# EAGLE design safecode-box (EAGLE 6.2)
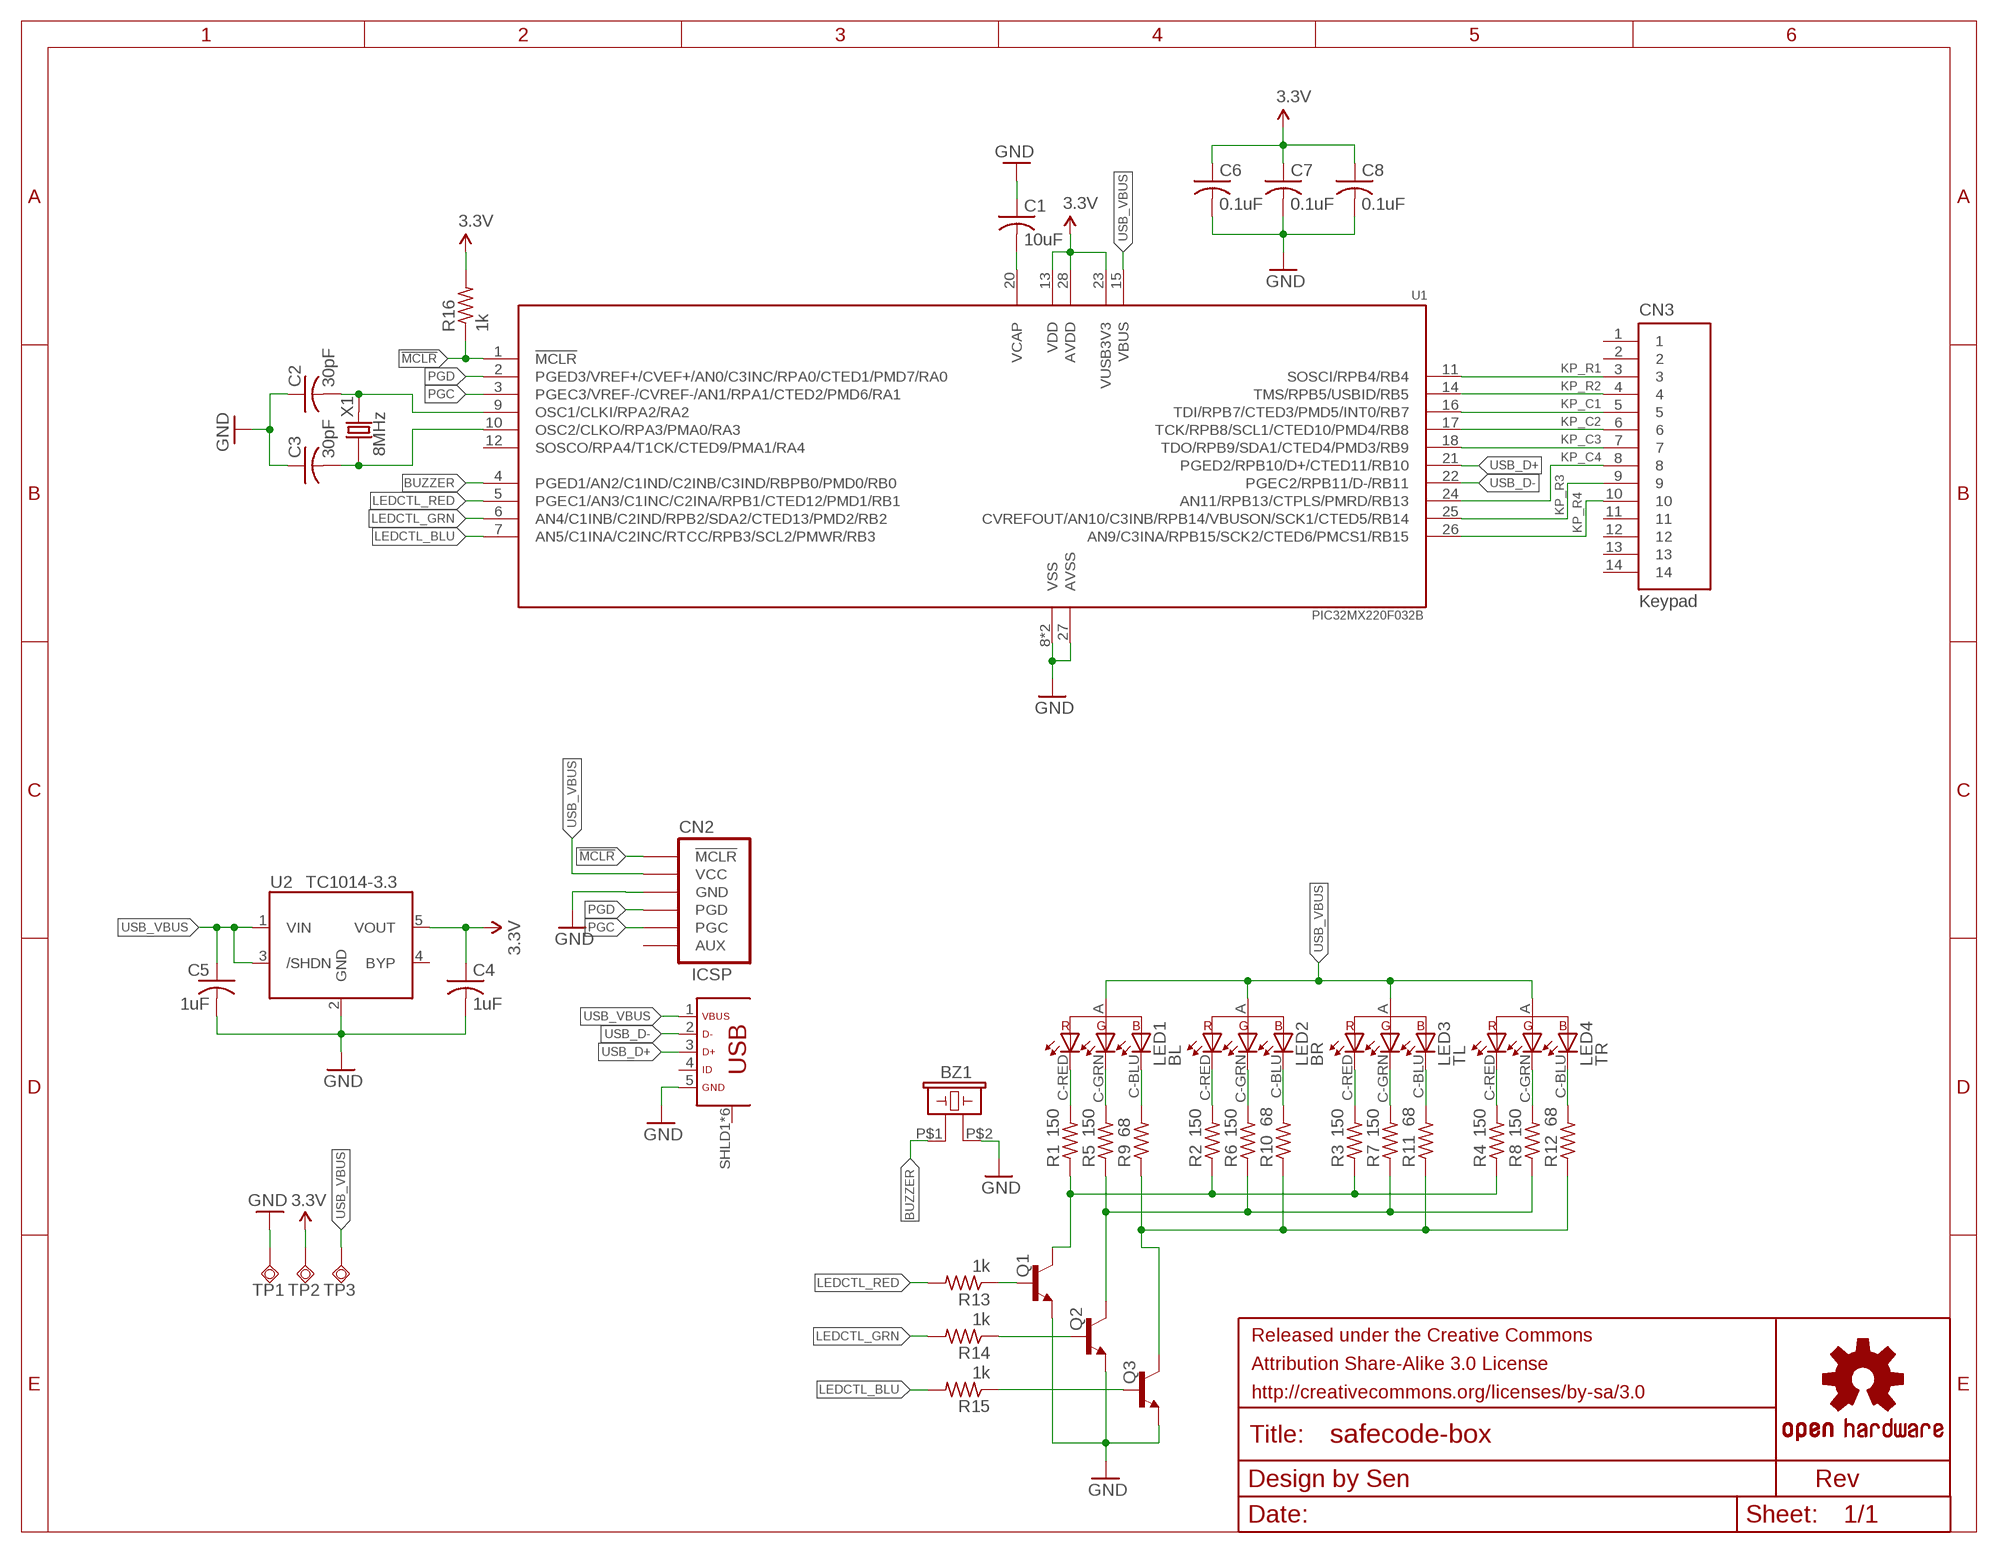
[diagram p0: schematic, sheet 1]

## Parts
BZ1  CMD-1603-SMD  [CMT-1603-SMD]
C1  10uF  C-USC0805  [C0805]
C2  30pF  C-USC0603  [C0603]
C3  30pF  C-USC0603  [C0603]
C4  1uF  C-USC0603  [C0603]
C5  1uF  C-USC0603  [C0603]
C6  0.1uF  C-USC0603  [C0603]
C7  0.1uF  C-USC0603  [C0603]
C8  0.1uF  C-USC0603  [C0603]
CN1  FCI-10118192-MICROUSB  [FCI-10118192-MICROUSB]
CN2  ICSP  ICSP-PADS  [ICSP-6PAD]
CN3  Keypad  3M-963114  [3M-963114]
FRAME1  FRAME-LETTER-GRID-OSHW-SENOSHW-LOGO-L  [OSHW-LOGO-L]
LED1  BL  AVAGO-HSMF-C113/115  [AVAGO-HSMF-C113/115]
LED2  BR  AVAGO-HSMF-C113/115  [AVAGO-HSMF-C113/115]
LED3  TL  AVAGO-HSMF-C113/115  [AVAGO-HSMF-C113/115]
LED4  TR  AVAGO-HSMF-C113/115  [AVAGO-HSMF-C113/115]
Q1  MMBT3904  MMBT3904LT1-NPN-SOT23-BEC  [SOT23-BEC]
Q2  MMBT3904  MMBT3904LT1-NPN-SOT23-BEC  [SOT23-BEC]
Q3  MMBT3904  MMBT3904LT1-NPN-SOT23-BEC  [SOT23-BEC]
R1  150  R-US_R0603  [R0603]
R2  150  R-US_R0603  [R0603]
R3  150  R-US_R0603  [R0603]
R4  150  R-US_R0603  [R0603]
R5  150  R-US_R0603  [R0603]
R6  150  R-US_R0603  [R0603]
R7  150  R-US_R0603  [R0603]
R8  150  R-US_R0603  [R0603]
R9  68  R-US_R0603  [R0603]
R10  68  R-US_R0603  [R0603]
R11  68  R-US_R0603  [R0603]
R12  68  R-US_R0603  [R0603]
R13  1k  R-US_R0603  [R0603]
R14  1k  R-US_R0603  [R0603]
R15  1k  R-US_R0603  [R0603]
R16  1k  R-US_R0603  [R0603]
TP1  GND  TPSQB2,54  [B2,54]
TP2  3.3V  TPSQB2,54  [B2,54]
TP3  VBUS  TPSQB2,54  [B2,54]
U1  PIC32MX220F032B  PIC32MX220FXXXB  [SO28W]
U2  TC1014-3.3  TC101X  [SOT23-5]
X1  8MHz  NX8045GB  [NX8045GB]

## Nets
3.3V: C4.1 C6.1 C7.1 C8.1 R16.2 TP2.TP U1.13(VDD) U1.23(VUSB3V3) U1.28(AVDD) U2.5(VOUT)
!MCLR: CN2.!MCLR R16.1 U1.1(!MCLR)
BL-B-R: LED1.C-BLU R9.2
BL-G-R: LED1.C-GRN R5.2
BL-R-R: LED1.C-RED R1.2
BR-B-R: LED2.C-BLU R10.2
BR-G-R: LED2.C-GRN R6.2
BR-R-R: LED2.C-RED R2.2
BUZZER: BZ1.P$1 U1.4(PGED1/AN2/C1IND/C2INB/C3IND/RBPB0/PMD0/RB0)
GND: BZ1.P$2 C1.1 C2.1 C3.1 C4.2 C5.2 C6.2 C7.2 C8.2 CN1.5(GND) CN2.GND Q1.E Q2.E Q3.E TP1.TP U1.8(VSS) U1.19(VSS) U1.27(AVSS) U2.2(GND)
KP_C1: CN3.5 U1.16(TDI/RPB7/CTED3/PMD5/INT0/RB7)
KP_C2: CN3.6 U1.17(TCK/RPB8/SCL1/CTED10/PMD4/RB8)
KP_C3: CN3.7 U1.18(TDO/RPB9/SDA1/CTED4/PMD3/RB9)
KP_C4: CN3.8 U1.24(AN11/RPB13/CTPLS/PMRD/RB13)
KP_R1: CN3.3 U1.11(SOSCI/RPB4/RB4)
KP_R2: CN3.4 U1.14(TMS/RPB5/USBID/RB5)
KP_R3: CN3.9 U1.25(CVREFOUT/AN10/C3INB/RPB14/VBUSON/SCK1/CTED5/RB14)
KP_R4: CN3.10 U1.26(AN9/C3INA/RPB15/SCK2/CTED6/PMCS1/RB15)
LED_C_BLU: Q3.C R9.1 R10.1 R11.1 R12.1
LED_C_GRN: Q2.C R5.1 R6.1 R7.1 R8.1
LED_C_RED: Q1.C R1.1 R2.1 R3.1 R4.1
LEDCTL_BLU: R15.2 U1.7(AN5/C1INA/C2INC/RTCC/RPB3/SCL2/PMWR/RB3)
LEDCTL_GRN: R14.2 U1.6(AN4/C1INB/C2IND/RPB2/SDA2/CTED13/PMD2/RB2)
LEDCTL_RED: R13.2 U1.5(PGEC1/AN3/C1INC/C2INA/RPB1/CTED12/PMD1/RB1)
OSC1: C2.2 U1.9(OSC1/CLKI/RPA2/RA2) X1.P$2
OSC2: C3.2 U1.10(OSC2/CLKO/RPA3/PMA0/RA3) X1.P$1
PGC: CN2.PGC U1.3(PGEC3/VREF-/CVREF-/AN1/RPA1/CTED2/PMD6/RA1)
PGD: CN2.PGD U1.2(PGED3/VREF+/CVEF+/AN0/C3INC/RPA0/CTED1/PMD7/RA0)
Q1-R: Q1.B R13.1
Q2-R: Q2.B R14.1
Q3-R: Q3.B R15.1
TL-B-R: LED3.C-BLU R11.2
TL-G-R: LED3.C-GRN R7.2
TL-R-R: LED3.C-RED R3.2
TR-B-R: LED4.C-BLU R12.2
TR-G-R: LED4.C-GRN R8.2
TR-R-R: LED4.C-RED R4.2
USB_D+: CN1.3(D+) U1.21(PGED2/RPB10/D+/CTED11/RB10)
USB_D-: CN1.2(D-) U1.22(PGEC2/RPB11/D-/RB11)
USB_VBUS: C5.1 CN1.1(VBUS) CN2.VCC LED1.A LED2.A LED3.A LED4.A TP3.TP U1.15(VBUS) U2.1(VIN) U2.3(/SHDN)
VCAP: C1.2 U1.20(VCAP)
Unconnected: CN1.4(ID) CN1.SHLD1(SHLD) CN1.SHLD2(SHLD) CN1.SHLD3(SHLD) CN1.SHLD4(SHLD) CN1.SHLD5(SHLD) CN1.SHLD6(SHLD) CN2.AUX CN3.1 CN3.2 CN3.11 CN3.12 CN3.13 CN3.14 U1.12(SOSCO/RPA4/T1CK/CTED9/PMA1/RA4) U2.4(BYP)

## Library data of the parts
BZ1 = speaker-sen:CMD-1603-SMD: CUI CMD-1603-SMD external-drive piezo speaker
C1-C8 = rcl:C-US: CAPACITOR, American symbol
CN1 = con-sen:FCI-10118192-MICROUSB: Micro USB-B SMD
CN2 = con-sen:ICSP-PADS
CN3 = con-sen:3M-963114: Pass-through 1x14 0.1" pitch female SMD header
FRAME1 = logos-sen:FRAME-LETTER-GRID-OSHW-SEN: Landscape letter-sized schematic frame w/ OSHW logo, edge grid; REV: 001
LED1-LED4 = led-sen:AVAGO-HSMF-C113/115: Avago HSMF-C113/115 right-angle SMD RGB LEDs
Q1-Q3 = transistor:*-NPN-: NPN Transistror BF959 corrected 2008.03.06
R1-R16 = rcl:R-US_: RESISTOR, American symbol
TP1-TP3 = testpad:TPSQ: Test pad
U1 = microchip-sen:PIC32MX220FXXXB
U2 = microchip-vreg:TC101X: Microchip TC1014/TC1015 LDO linear regulators
X1 = crystal-sen:NX8045GB

## Board
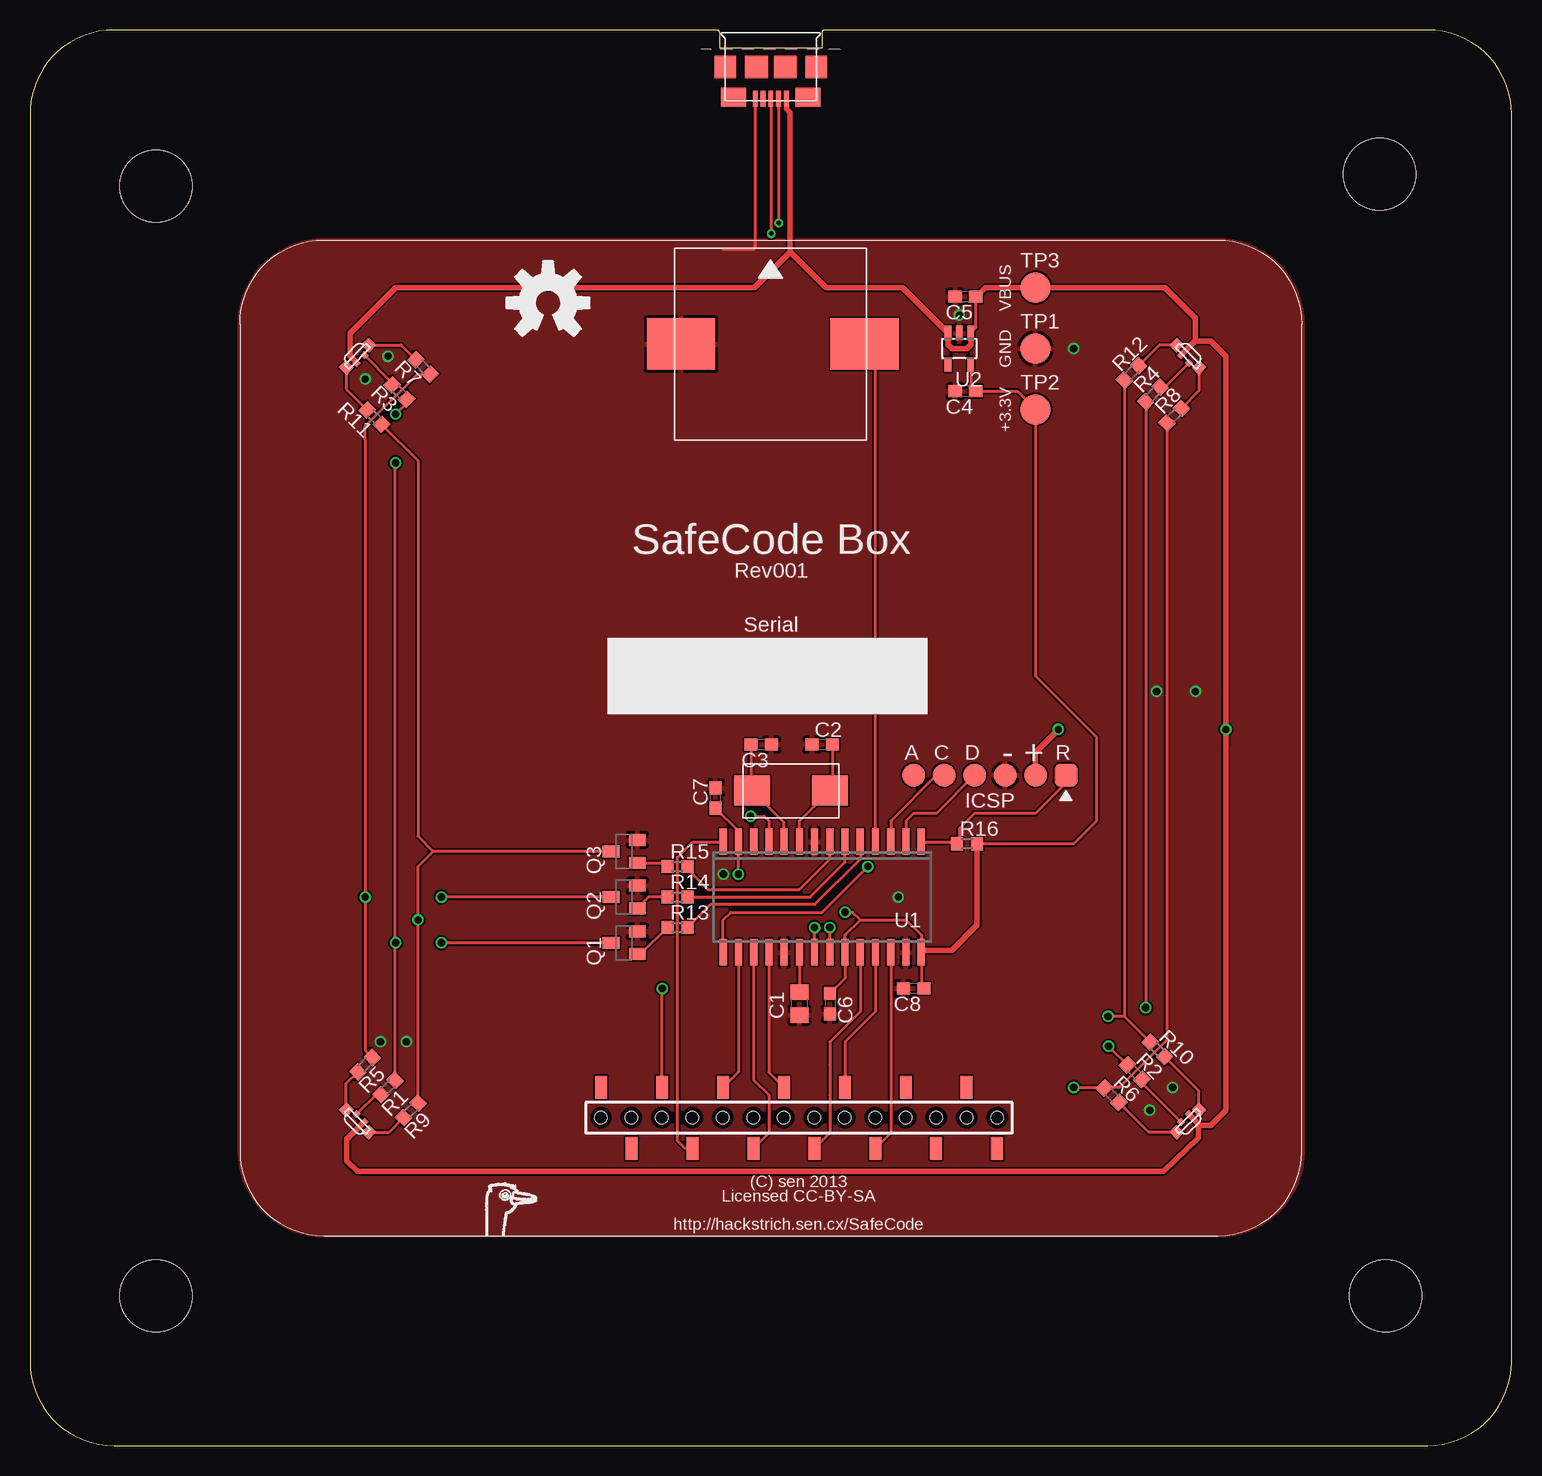
[diagram p1: board, top side]
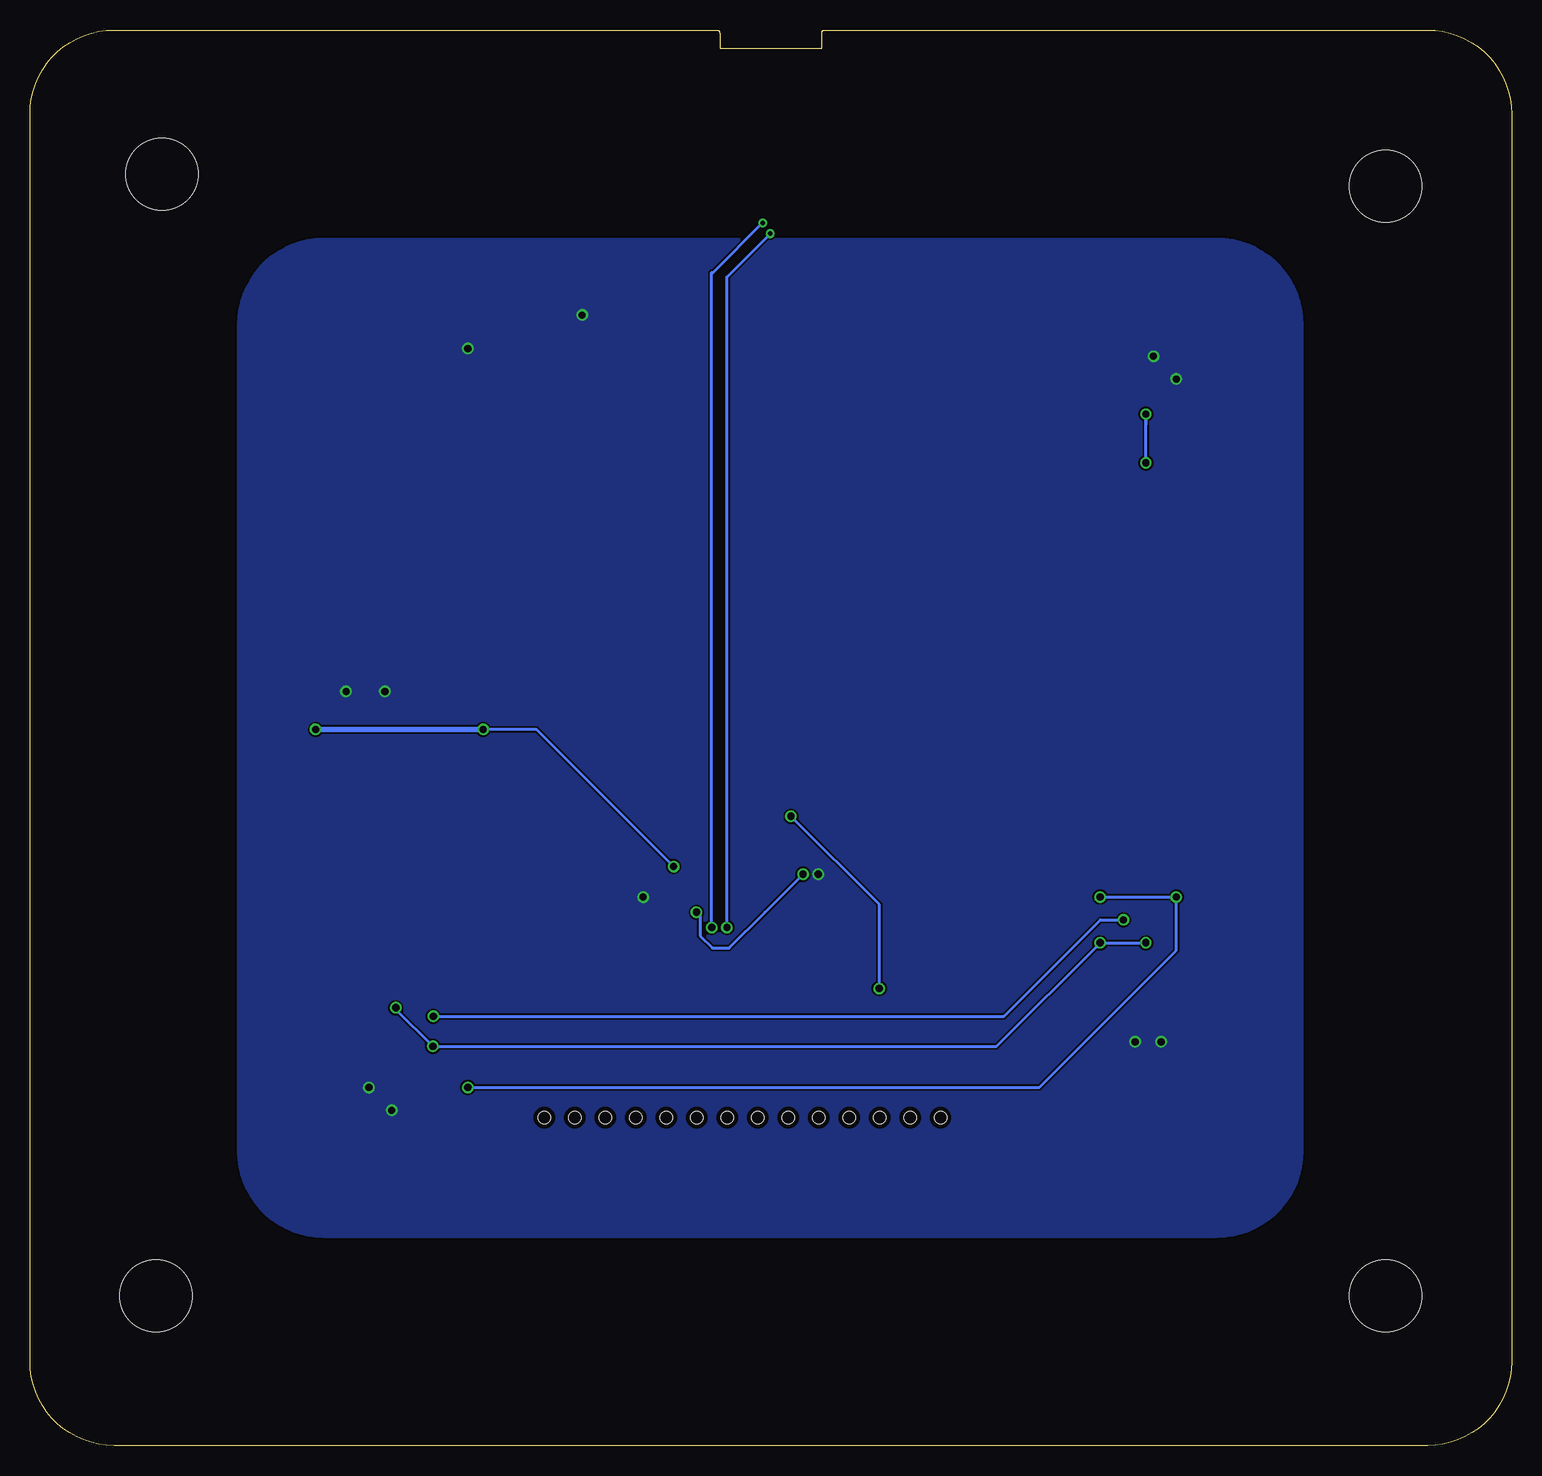
[diagram p2: board, bottom side, seen from below]

Size 123.5 x 118 mm. Coordinates in mm from the lower left corner, seen from the top.
Outline: 0,111 0,7 arc90 7,0 116.5,0 arc90 123.5,7 123.5,111 arc90 116.5,118 66.25,118 arc90 66,117.75 66,116.47 57.5,116.47 57.5,117.75 arc90 57.25,118 7,118 arc90 0,111
Copper layers (1*16): Top 0.0356mm / dielectric 1.5011mm / Bottom 0.0356mm
Design rules: minimum track width 6mil, minimum drill 13mil, track to track 6mil, track to pad 6mil, pad to pad 6mil, via to via 6mil, smd to smd 6mil, copper to edge 15mil, drill to drill 6mil, minimum pad ring 7mil, minimum via ring 7mil, stop-mask expansion 4mil, vias tented up to drill 0mil, thermal gap 10mil
Holes 6 mm at 10.5,12.47 10.5,104.97 112.5,105.97 113,12.47

### Footprints (pad centres in the part's own frame; a part is rotated, then mirrored left to right if it is on the bottom)
CMT-1603-SMD = smd 5.7 x 4.3: P$1 -7.85,0; P$2 7.45,0
C0805 = smd 1.3 x 1.5: 1 -0.95,0; 2 0.95,0
C0603 = smd 1.1 x 1: 1 -0.85,0; 2 0.85,0
FCI-10118192-MICROUSB = smd 0.4 x 1.35: 1 -1.3,2.675; 2 -0.65,2.675; 3 0,2.675; 4 0.65,2.675; 5 1.3,2.675 | smd 1.8 x 1.9: SHLD1 -3.8,0.025; SHLD4 3.8,0.025 | smd 1.9 x 1.9: SHLD2 -1.2,0.025; SHLD3 1.2,0.025 | smd 2.1 x 1.6: SHLD5 -3.1,2.55; SHLD6 3.1,2.55
ICSP-6PAD = smd 1.905 x 1.905: !MCLR -6.35,0; AUX 6.35,0; GND -1.27,0; PGC 3.81,0; PGD 1.27,0; VCC -3.81,0
3M-963114 = smd 1 x 1.9: 1 -16.51,2.54; 2 -13.97,-2.54; 3 -11.43,2.54; 4 -8.89,-2.54; 5 -6.35,2.54; 6 -3.81,-2.54; 7 -1.27,2.54; 8 1.27,-2.54; 9 3.81,2.54; 10 6.35,-2.54; 11 8.89,2.54; 12 11.43,-2.54; 13 13.97,2.54; 14 16.51,-2.54 | hole 1.02: -16.51,0; -13.97,0; -11.43,0; -8.89,0; -6.35,0; -3.81,0; -1.27,0; 1.27,0; 3.81,0; 6.35,0; 8.89,0; 11.43,0; 13.97,0; 16.51,0
AVAGO-HSMF-C113/115 = smd 0.45 x 0.5: A -0.469,-0.35; C-RED 0.469,-0.35 | smd 0.85 x 0.9: C-BLU -1.325,0; C-GRN 1.325,0
SOT23-BEC = smd 1 x 1.4: B -0.95,-1.1; C 0,1.1; E 0.95,-1.1
R0603 = smd 1 x 1.1: 1 -0.85,0; 2 0.85,0
B2,54 = smd 2.54 x 2.54: TP 0,0
SO28W = smd 0.6 x 2.2: 1 -8.255,-4.6; 2 -6.985,-4.6; 3 -5.715,-4.6; 4 -4.445,-4.6; 5 -3.175,-4.6; 6 -1.905,-4.6; 7 -0.635,-4.6; 8 0.635,-4.6; 9 1.905,-4.6; 10 3.175,-4.6; 11 4.445,-4.6; 12 5.715,-4.6; 13 6.985,-4.6; 14 8.255,-4.6; 15 8.255,4.6; 16 6.985,4.6; 17 5.715,4.6; 18 4.445,4.6; 19 3.175,4.6; 20 1.905,4.6; 21 0.635,4.6; 22 -0.635,4.6; 23 -1.905,4.6; 24 -3.175,4.6; 25 -4.445,4.6; 26 -5.715,4.6; 27 -6.985,4.6; 28 -8.255,4.6
SOT23-5 = smd 0.55 x 1.2: 1 -0.95,-1.3; 2 0,-1.3; 3 0.95,-1.3; 4 0.95,1.3; 5 -0.95,1.3
NX8045GB = smd 3 x 2.5: P$1 -3.324,0.001; P$2 3.176,0.001

### Placement (x,y rotation side)
BZ1  61.72,91.82 180 top
C1  64.14,36.83 90 top
C2  66.04,58.42 0 top
C3  60.96,58.42 180 top
C4  77.98,87.88 180 top
C5  77.98,95.76 180 top
C6  66.67,36.83 270 top
C7  57.15,53.98 90 top
C8  73.66,38.1 180 top
CN1  61.75,114.94 180 top
CN2  80.01,55.88 180 top
CN3  64.11,27.32 0 top
FRAME1  43.18,95.25 0 top
LED1  27.3,27.05 135 top
LED2  96.52,27.05 225 top
LED3  27.3,90.8 45 top
LED4  96.52,90.8 315 top
Q1  49.53,41.91 90 top
Q2  49.53,45.72 90 top
Q3  49.53,49.53 90 top
R1  29.84,29.84 225 top
R2  92.08,31.12 315 top
R3  30.79,87.82 135 top
R4  93.61,87.63 45 top
R5  27.94,31.75 225 top
R6  90.17,29.21 315 top
R7  32.77,89.92 135 top
R8  95.38,85.85 45 top
R9  31.75,27.94 225 top
R10  93.98,33.02 315 top
R11  28.71,85.72 135 top
R12  91.82,89.41 45 top
R13  53.98,43.18 0 top
R14  53.98,45.72 0 top
R15  53.98,48.26 0 top
R16  78.11,50.16 0 top
TP1  83.82,91.44 0 top
TP2  83.82,86.36 0 top
TP3  83.82,96.52 0 top
U1  66.04,45.72 180 top
U2  77.47,91.44 180 top
U$1  [STRICH-LOGO-R]  38.73,19.56 0 top
X1  63.5,54.61 0 top

### Tracks (layer width: path | path; a pad name or v marks a point on that pad's centre or on a via)
3.3V  (via drill 0.6)
  Top 0.254: U2.5 78.42,88.29 C4.1 82.3,87.88 TP2.TP 83.82,64.14 88.9,59.05 88.9,52.07 87,50.16 R16.2 | C7.1 59.05,51.22 U1.13 v59.05,47.62 | C8.1 74.3,38.31 U1.28 74.3,42.55 73.03,43.81 69.22,43.81 | 67.94,42.55 U1.23 67.94,38.95 C6.1 | 67.94,42.55 69.22,43.81 | 67.94,42.55 69.22,43.81 | 69.22,43.81 68.58,44.45 v67.94,44.45
  Top 0.457: R16.2 78.95,43.4 76.83,41.27 74.45,41.27 U1.28
  Bottom 0.254: v59.05,47.62 62.23,44.45 65.22,41.47 66.61,41.47 67.63,42.48 67.63,44.13 v67.94,44.45
!MCLR
  Top 0.254: CN2.!MCLR 86.36,55.24 83.82,52.7 78.74,52.7 77.47,51.44 77.47,50.38 R16.1 77.1,50.32 U1.1
BL-B-R
  Top 0.254: LED1.C-BLU 29.92,26.11 R9.2
BL-G-R
  Top 0.254: LED1.C-GRN 26.37,30.18 R5.2
BL-R-R
  Top 0.254: R1.2 28.84,29.24 LED1.C-RED
BR-B-R
  Top 0.254: LED2.C-BLU 97.46,29.54 R10.2
BR-G-R
  Top 0.254: LED2.C-GRN 93.27,26.11 R6.2
BR-R-R
  Top 0.254: R2.2 92.68,30.23 LED2.C-RED
BUZZER
  Top 0.254: U1.4 70.48,90.17 70.17,90.49 | 70.17,90.49 69.85,90.8 | BZ1.P$1 69.57,91.08 70.17,90.49
GND  (via drill 0.6)
  Top 0.254: CN1.5 60.45,99.82 60.33,99.69 57.78,99.69 | 53.98,91.44 54.61,92.08
  Top 0.457: 54.61,92.08 54.53,92.08 BZ1.P$2
  other vias: 87,91.44 77.47,94.23 97.16,62.87 93.92,62.87 93.34,27.94 95.25,29.84 29.21,33.66 31.37,33.66 27.94,88.9 29.84,90.8 72.39,45.72 57.78,47.62
  pour Bottom: 106.05,93.46 106.05,24.53 arc-90 99.05,17.53 24.53,17.53 arc-90 17.53,24.53 17.53,93.46 arc-90 24.53,100.46 99.05,100.46 arc-90
  pour Top: 106.05,93.46 106.05,24.53 arc-90 99.05,17.53 24.53,17.53 arc-90 17.53,24.53 17.53,93.46 arc-90 24.53,100.46 99.05,100.46 arc-90
KP_C1
  Top 0.254: U1.16 59.05,31.16 CN3.5
KP_C2
  Top 0.254: U1.17 60.33,30.48 61.59,29.21 61.59,26.08 CN3.6
KP_C3
  Top 0.254: U1.18 61.59,31.11 CN3.7
KP_C4
  Top 0.254: U1.24 69.22,36.2 66.67,33.66 66.67,31.75 66.67,29.21 66.67,26.08 CN3.8
KP_R1  (via drill 0.6)
  Top 0.254: CN3.3 52.68,38.08 v52.7,38.1 | v60.07,52.45 61.21,52.45 61.59,52.07 U1.11
  Bottom 0.254: v52.7,38.1 52.7,45.09 v60.07,52.45
KP_R2
  Top 0.254: CN3.4 54.59,24.78 53.98,25.4 53.98,49.02 55.24,50.29 57.76,50.29 U1.14
KP_R3
  Top 0.254: U1.25 70.48,36.2 67.94,33.66 67.94,29.88 CN3.9
KP_R4
  Top 0.254: U1.26 71.75,26.08 CN3.10
LED_C_BLU  (via drill 0.6)
  Top 0.254: R12.1 91.22,35.78 | 91.22,35.78 R10.1 | R9.1 v32.35,43.81 | v32.35,43.81 32.35,44.45 | 32.35,44.45 32.35,48.26 33.62,49.53 | R11.1 32.35,82.08 32.35,50.8 33.62,49.53 | Q3.C 33.62,49.53 | 91.22,35.78 v89.88,35.78 | v32.35,43.81 32.35,44.45
  Bottom 0.254: v89.88,35.78 42.33,35.78 34.29,43.81 v32.35,43.81
LED_C_GRN  (via drill 0.6)
  Top 0.254: R8.1 94.78,33.82 90.81,29.84 89.6,29.84 R6.1 87.03,29.81 v87,29.84 | R7.1 33.33,89.28 32.26,89.28 27.94,84.96 27.94,83.82 v27.94,45.72 27.94,32.95 R5.1 | Q2.C v34.29,45.72
  Bottom 0.254: v34.29,45.72 v27.94,45.72 27.94,41.27 39.37,29.84 v87,29.84
LED_C_RED  (via drill 0.6)
  Top 0.254: R4.1 v93.01,36.49 | v89.92,33.27 | v89.92,33.27 R2.1 | R1.1 30.45,41.91 | 30.45,41.91 30.45,81.88 v30.48,81.91 | R3.1 31.39,86.89 v30.48,85.98 | Q1.C v34.29,41.91 | v30.48,41.91 30.45,41.91
  Bottom 0.254: v93.01,36.49 93.01,36.37 v89.92,33.27 42.93,33.27 v34.29,41.91 v30.48,41.91 30.45,41.91 | v30.48,81.91 30.48,85.09 | 30.48,85.09 v30.48,85.98 30.48,85.09
LEDCTL_BLU
  Top 0.254: U1.7 66.67,48.89 64.14,46.35 56.52,46.35 54.83,48.05 R15.2
LEDCTL_GRN
  Top 0.254: R14.2 65.02,45.72 67.94,48.64 U1.6
LEDCTL_RED
  Top 0.254: U1.5 69.22,48.89 65.41,45.09 56.73,45.09 R13.2
OSC1
  Top 0.254: C2.2 66.89,54.82 X1.P$2 64.14,52.07 U1.9
OSC2
  Top 0.254: C3.2 60.11,54.68 X1.P$1 62.87,51.92 U1.10
PGC
  Top 0.254: CN2.PGC 75.56,55.88 71.75,52.07 U1.3 | U1.3 71.75,49.53 U1.3
PGD
  Top 0.254: CN2.PGD 75.56,52.7 73.66,52.7 73.03,52.07 U1.2
Q1-R
  Top 0.254: Q1.B 50.91,40.96 R13.1
Q2-R
  Top 0.254: R14.1 51.58,45.72 Q2.B
Q3-R
  Top 0.254: Q3.B 52.8,48.58 R15.1
TL-B-R
  Top 0.254: LED3.C-BLU 26.37,88.07 R11.2
TL-G-R
  Top 0.254: LED3.C-GRN 30.94,91.74 R7.2
TL-R-R
  Top 0.254: R3.2 30.07,88.71 LED3.C-RED
TR-B-R
  Top 0.254: LED4.C-BLU 94.16,91.74 R12.2
TR-G-R
  Top 0.254: LED4.C-GRN 97.46,87.93 R8.2
TR-R-R
  Top 0.254: R4.2 94.61,88.23 LED4.C-RED
USB_D+  (via drill 0.38, 0.6)
  Top 0.254: U1.21 v65.41,43.18 | CN1.3 61.75,101.06 v61.78,101.03
  Bottom 0.254: v65.41,43.18 65.41,97.41 v61.78,101.03
USB_D-  (via drill 0.38, 0.6)
  Top 0.254: U1.22 v66.67,43.18 | v62.42,101.92 62.42,112.24 CN1.2
  Bottom 0.254: v66.67,43.18 66.67,97.79 66.55,97.79 v62.42,101.92
USB_VBUS  (via drill 0.6)
  Top 0.254: 83.06,95.76 TP3.TP | C5.1 78.83,93.15 U2.1 | LED2.A 96.6,27.6 | 97.18,92.08 97.16,92.1 | U1.15 57.78,43.81 58.42,44.45 66.04,44.45 v69.85,48.26
  Top 0.457: 63.37,99.51 66.36,96.52 72.74,96.52 U2.3 76.52,91.75 76.83,91.44 78.11,91.44 78.42,91.75 U2.1 | LED4.A 97.16,92.1 97.16,93.98 94.61,96.52 TP3.TP 79.63,96.52 78.87,95.76 C5.1 | 96.6,27.6 97.54,26.67 | 97.54,26.67 98.42,26.67 99.69,27.94 99.69,58.42 | 99.69,58.42 v99.69,59.69 | v99.69,59.69 99.69,90.8 98.42,92.08 97.18,92.08 | 27.88,27 LED1.A 27.86,26.97 26.42,25.53 26.42,23.75 27.3,22.86 27.56,22.86 94.49,22.86 97.41,25.65 97.41,26.54 97.54,26.67 | 63.37,99.51 63.37,99.5 60.39,96.52 30.48,96.52 26.67,92.71 26.67,90.8 27.22,90.25 LED3.A | CN2.VCC 83.82,57.78 v85.72,59.69 | v99.69,59.69 99.69,58.42 | CN1.1 63.05,111.45 63.37,111.12 63.37,100.65 63.37,99.52 63.37,99.51
  Bottom 0.254: v69.85,48.26 81.28,59.69 v85.72,59.69
  Bottom 0.457: v85.72,59.69 v99.69,59.69
VCAP
  Top 0.254: U1.20 C1.2

### Text on the board
tPlace: VBUS | GND | +3.3V | SafeCode Box | Rev001 | Serial | ICSP | (C) sen 2013 | Licensed CC-BY-SA | http://hackstrich.sen.cx/SafeCode